# Altium schematic sheet Charger.SchDoc
size A4; SheetNumber: 3; SheetTotal: 3
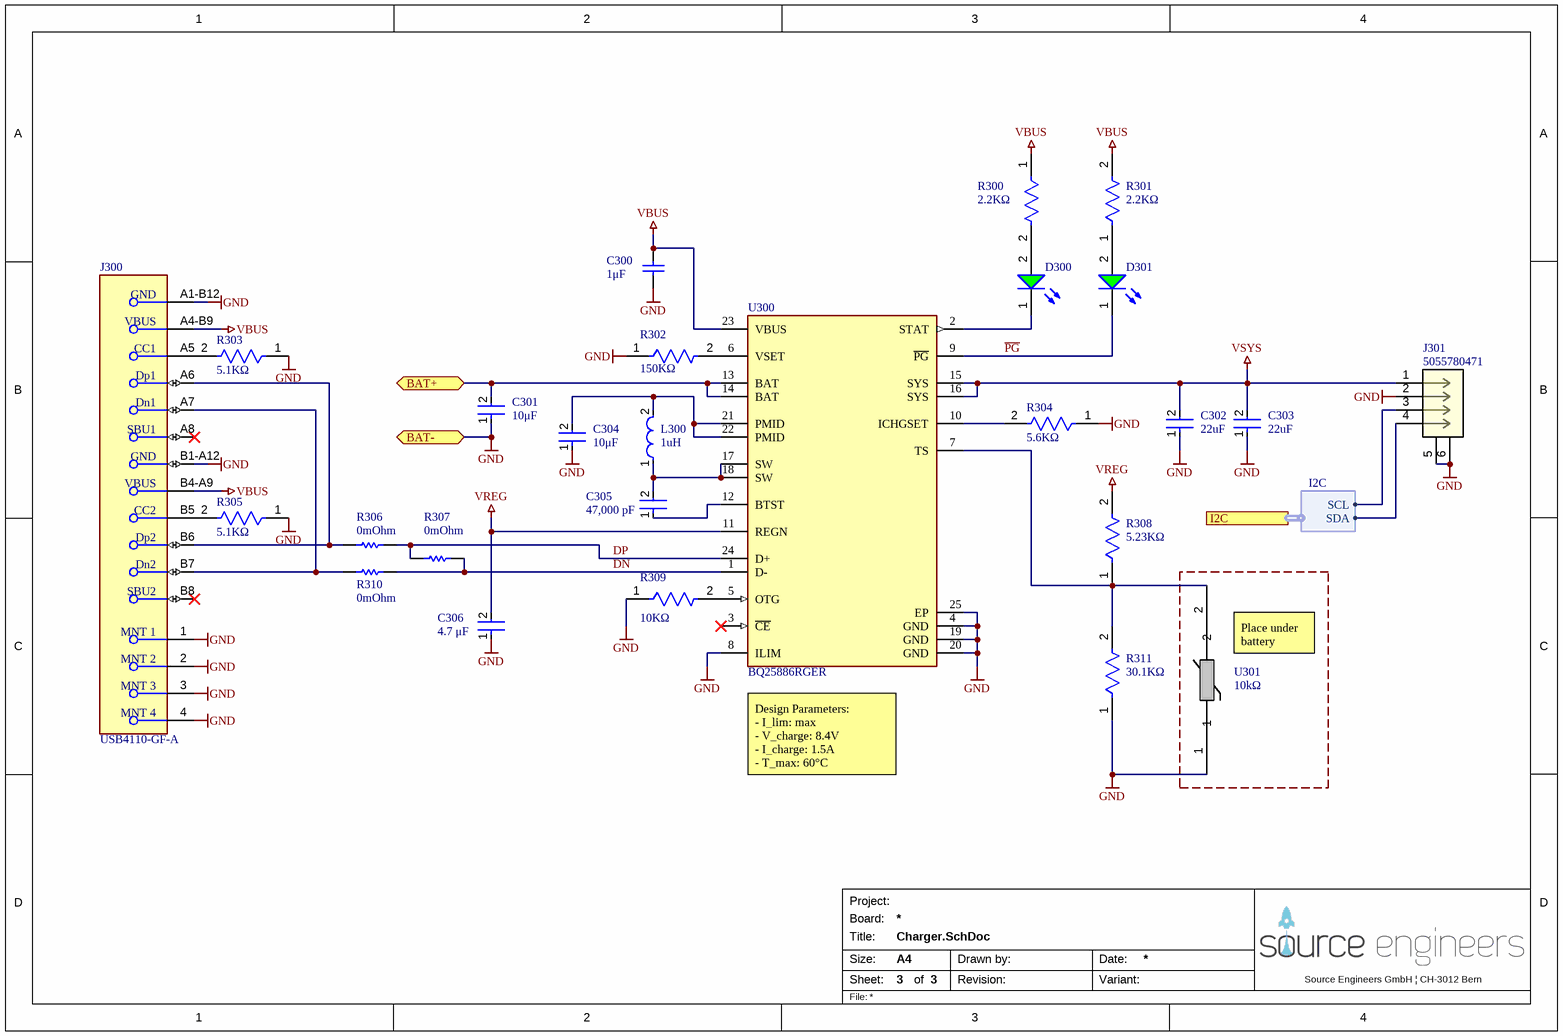
[diagram p0: Charger.SchDoc]

## Parts
C300  Parameter 1: 1μF  [CAPC2013X95X45NL10T25]  (hidden comment: GRM219R71E105KA88D)
C301  value 10μF  [FP-GRM31C-0_2-e0_3_0_8-IPC_B]  (hidden comment: GRM31CR71E106MA12K)
C302  Capacitance: 22uF  [FP-GRM32E-0_3-0_2-MFG]  (hidden comment: GRM32ER71E226ME15K)
C303  Capacitance: 22uF  [FP-GRM32E-0_3-0_2-MFG]  (hidden comment: GRM32ER71E226ME15K)
C304  value 10μF  [FP-GRM31C-0_2-e0_3_0_8-IPC_B]  (hidden comment: GRM31CR71E106MA12K)
C305  value 47,000 pF  [FP-C0603C-CF-MFG]  (hidden comment: C0603C473M5RACTU)
C306  Parameter 1: 4.7 μF  [FP-GRM188-0_15-IPC_B]  (hidden comment: GRM188Z71A475ME15D)
D300  155060VS75300  [WL-SMSW_0603_L1.6W0.98H0.8]  (value not drawn)
D301  155060VS75300  [WL-SMSW_0603_L1.6W0.98H0.8]  (value not drawn)
J300  USB4110-GF-A  [FP-USB4110-GF-A-MFG]
J301  5055780471  [CONN_505578_04_MOL]
L300  Inductance: 1uH  [FP-IHLP-2525CZ-FP_2_413x3-MFG]  (hidden comment: IHLP2525CZER1R0M01)
R300  value 2.2KΩ  [FP-RT0603-MFG]  (hidden comment: RT0603FRE072K2L)
R301  value 2.2KΩ  [FP-RT0603-MFG]  (hidden comment: RT0603FRE072K2L)
R302  value 150KΩ  [FP-RT0603-MFG]  (hidden comment: RT0603FRE07150KL)
R303  Resistance: 5.1KΩ  [FP-RT0603-MFG]  (hidden comment: RT0603FRE075K1L)
R304  value 5.6KΩ  [FP-RT0603-MFG]  (hidden comment: RT0603FRE075K6L)
R305  Resistance: 5.1KΩ  [FP-RT0603-MFG]  (hidden comment: RT0603FRE075K1L)
R306  Resistance: 0mOhm  [RESC1608X55X25ML10T15]  (hidden comment: RC0603JR-070RL)
R307  Resistance: 0mOhm  [RESC1608X55X25ML10T15]  (hidden comment: RC0603JR-070RL)
R308  value 5.23KΩ  [FP-RT0603-MFG]  (hidden comment: RT0603FRE075K23L)
R309  value 10KΩ  [FP-RT0603-MFG]  (hidden comment: RT0603FRE0710KL)
R310  Resistance: 0mOhm  [RESC1608X55X25ML10T15]  (hidden comment: RC0603JR-070RL)
R311  value 30.1KΩ  [FP-RT0603-MFG]  (hidden comment: RT0603FRE0730K1L)
U300  BQ25886RGER  [FP-RGE0024H-IPC_C]
U301  Resistance: 10kΩ  [NTCS0603_VIS]  (hidden comment: NTCS0603E3103FLT)

## Ports
BAT+ (bidir, see Top[3B], MonitoringProtection[1A]), BAT- (bidir, see Top[3B], MonitoringProtection[1D]), I2C (harness I2C, see Top[3C], MonitoringProtection[1C])

## Harnesses
I2C: SCL, SDA

## Nets
GND: C300.1 C301.1 C302.1 C303.1 C304.1 C306.1 J300.1(MNT_1) J300.2(MNT_2) J300.3(MNT_3) J300.4(MNT_4) J300.A1-B12(GND) J300.B1-A12(GND) J301.2 J301.5 J301.6 R302.1 R303.1 R304.1 R305.1 R309.1 R311.1 U300.4(GND) U300.8(ILIM) U300.19(GND) U300.20(GND) U300.25(EP) U301.1 ; port BAT-
VBUS: C300.2 J300.A4-B9(VBUS) J300.B4-A9(VBUS) R300.1 R301.2 U300.23(VBUS)
VREG: C306.2 R308.2 U300.11(REGN)
VSYS: C302.2 C303.2 J301.1 U300.15(SYS) U300.16(SYS)
BAT+: C301.2 U300.13(BAT) U300.14(BAT) ; port BAT+
DN: R307.1 R310.1 U300.1(D-)
DP: R306.1 R307.2 U300.24(D+)
~{PG}: D301.1(K) U300.9(~{PG})
NetC304_2: C304.2 L300.2 U300.21(PMID) U300.22(PMID)
NetC305_1: C305.1 U300.12(BTST)
NetC305_2: C305.2 L300.1 U300.17(SW) U300.18(SW)
NetD300_1: D300.1(K) U300.2(STAT)
NetD300_2: D300.2(A) R300.2
NetD301_2: D301.2(A) R301.1
NetJ300_A5: J300.A5(CC1) R303.2
NetJ300_A6: J300.A6(Dp1) J300.B6(Dp2) R306.2
NetJ300_A7: J300.A7(Dn1) J300.B7(Dn2) R310.2
NetJ300_B5: J300.B5(CC2) R305.2
NetJ301_3: J301.3 ; port I2C.SCL
NetJ301_4: J301.4 ; port I2C.SDA
NetR302_2: R302.2 U300.6(VSET)
NetR304_2: R304.2 U300.10(ICHGSET)
NetR308_1: R308.1 R311.2 U300.7(TS) U301.2
NetR309_2: R309.2 U300.5(OTG)

Not connected (* = marked no-connect by the designer): J300 A8(SBU1)* B8(SBU2)*; U300 3(~{CE})*

## Notes on the sheet
- (near U301) Place under battery
- (near U300) Design Parameters:
  - I_lim: max
  - V_charge: 8.4V
  - I_charge: 1.5A
  - T_max: 60°C
- Project:
- Board:
- Title:
- Size:
- Sheet:
- A4
- of
- Drawn by:
- Revision:
- Date:
- Variant:
- Source Engineers GmbH | CH-3012 Bern
- File:

## Library data of the parts
C300 = CMP-1036-04754-2: Manufacturer: Murata; Part Number: GRM219R71E105KA88D
C301 C304 = CMP-06035-043219-1: Chip Multilayer Ceramic Capacitors for General Purpose, 1206, 10uF, X7R, 15%, 20%, 25V
C302 C303 = CMP-06035-000114-2: Chip Multilayer Ceramic Capacitors for General Purpose, 1210, 22uF, X7R, 15%, 20%, 25V; Case Code (Metric): 3225; Thickness: 0.106inch; Voltage Rating: 25V; Weight: 0.00388oz; Width: 0.098inch; Case Code (Imperial): 1210; Tolerance: 20%; Termination: SMD/SMT; Packaging: Tape and Reel; Case/Package: 1210; Height: 2.5mm; Mount: Surface Mount; Voltage Rating (DC): 25V; Resistor Type: Ceramic; Voltage: 25V; Dielectric: X7R; Package Quantity: 4000; Min Operating Temperature: -55°C; Max Operating Temperature: 125°C; Length: 0.126inch
C305 = CMP-2006-03851-2: CAP CER 0.047UF 50V X7R 0603; Manufacturer: KEMET; Temperature Coefficient: 30ppm/°C; Automotive Grade: Grade 1; Tolerance: 0.2; Material: Ceramic; Voltage Rating: 50 V; Manufacturer Part Number: C0603C473M5RACTU; Device Class L1: Passive Components; Temperature Range High: +125°C; Height: 0.87mm; Device Class L3: Ceramic Capacitors; Capacitance: 47,000 pF; Digikey Description: CAP CER 0.047UF 50V X7R 0603; Temperature Range Low: -55°C; Temperature: -55°C to +125°C; Mouser Description: Cap Ceramic 0.047uF 50V X7R 20% SMD 0603 125°C Paper T/R; ComponentLink2URL: https://api.kemet.com/component-edge/download/datasheet/C0603C100J5GACAUTO.pdf; Package: C0603C-CF; Automotive: Yes; RoHS: TRUE; ComponentLink2Description: Datasheet; Lead Free: Yes; Device Class L2: Capacitors; Temperature Characteristic: X7R; Category: Cap; Octopart: https://octopart.com/c0603c473m5ractu-kemet-9140001
C306 = CMP-06035-024346-1: Chip Multilayer Ceramic Capacitors for General Purpose, 0603, 4.7uF, X7R, 15%, 20%, 10V; Case/Package: 0603
D300 D301 = CMP-03913-108242161-1: 155060VS75300 Led, Green, 60Mcd, 570Nm Rohs Compliant: Yes; Max Reverse Voltage (DC): 5V; Peak Wavelength: 572nm; Viewing Angle: 140°; Forward Current: 30mA; Forward Voltage: 2V; Max Operating Temperature: 85°C; Luminous Intensity: 60mcd; RoHS: Compliant; Width: 980µm; Length: 1.6mm; Min Operating Temperature: -40°C; Dominant Wavelength: 570nm; Height: 800µm; NexarPartId: 108242161
J300 = CMP-245163-000002-1: CONN USB 2.0 TYPE-C R/A SMT; Manufacturer: GCT; Conn Orientation: Right Angle; Usb Standard: USB 2.0; Voltage Rating: 20V; Current Rating: 3/4.25/1.25/0.25A; Number Of Contacts: 16; Is Female: yes; Shielding: true; Standoff Height: 0.1mm; Octopart: https://octopart.com/usb4110-gf-a-gct-103941985; Temperature: -40°C to +85°C; RoHS: TRUE; Automotive: No; Contact Material: Gold,Nickel; Device Class L1: Connectors; Device Class L2: USB Connectors; Package: 0; Lead Free: Yes; ComponentLink2URL: https://gct.co/files/drawings/usb4110.pdf; Temperature Range High: +85°C; Temperature Range Low: -40°C; Height: 3.46mm; Manufacturer Part Number: USB4110-GF-A; ComponentLink2Description: Datasheet; Device Class L3: unset; Digikey Description: CONN USB 2.0 TYPE-C R/A SMT; Category: Conn
J301 = 5055780471: 2.00mm Pitch, Micro-Lock Plus PCB Header, Single Row, Right-Angle, Surface Mount, Matte Tin Plating, Positive Lock, 4 Circuits, Low-Halogen, Black; Manufacturer_Name: Molex Connector Corporation; Copyright: Copyright (C) 2025 Ultra Librarian. All rights reserved.; Manufacturer_Part_Number: 5055780471; Datasheet: https://www.molex.com/en-us/products/part-detail-pdf/5055780471?display=pdf; RefDes: RefDes; Type: Type; Supplier 1: DigiKey; Supplier Part Number 1: WM17949CT-ND; Supplier 2: DigiKey; Supplier Part Number 2: WM17949DKR-ND; Supplier 3: Mouser; Supplier Part Number 3: 538-505578-0471
L300 = CMP-02424-000599-1: Commercial Inductors, High Saturation Series 1uH 11A 10mΩ 20%; Self Resonant Frequency: 5MHz; Test Frequency: 100kHz; Shielding: Shielded; Core Material: Metal; Saturation Current: 22A; DC Resistance (DCR): 10mR; Current Rating: 11A; Packaging: Tape and Reel; Width: 6.47mm; Number of Pins: 2; Case/Package: 2525; Termination: SMD/SMT; Length: 7.24mm; Height: 3mm; Min Operating Temperature: -55°C; Mount: Surface Mount; Inductance Tolerance: 20%; Max Operating Temperature: 125°C; Military Standard: Not; Max DC Current: 11A; RMS Current (Irms): 11A; Lead Free: Lead Free; Depth: 6.72mm; Tolerance: 20%; Package Quantity: 2000; Radiation Hardening: No; Contact Plating: Tin
R300 R301 = CMP-03412-033768-1: RES SMD 2.2K OHM 1% 1/10W 0603; Manufacturer: Yageo; Temperature Coefficient: 50 ppm/°C; Power Rating: 0.1W; Tolerance: 0.01; Voltage Rating: 75V; Package: RT0603; Digikey Description: RES SMD 2.2K OHM 1% 1/10W 0603; Octopart: https://octopart.com/rt0603fre072k2l-yageo-40019811; ComponentLink2URL: http://www.yageo.com/documents/recent/PYu-RT_1-to-0.01_RoHS_L_9.pdf; Temperature Range Low: -55°C; Height: 0.55mm; Footprint Url: http://www.yageo.com/exep/pages/download/literatures/PYu-R_Mount_10.pdf; ComponentLink2Description: Datasheet; Device Class L1: Passive Components; RoHS: TRUE; Device Class L3: Chip SMD Resistors; Composition: Thin Film; Device Class L2: Resistors; Manufacturer Part Number: RT0603FRE072K2L; Mouser Description: High Precision-High Stability Chip Resistor Thin Film 0603 2.2kOhm 1% Paper T/R; Automotive: No; Category: Res; Temperature Range High: +155°C; Lead Free: Yes; Resistance: 2.2KΩ; Temperature: -55°C to +155°C; Series: RT; Ipc Land Pattern Name: RESC16080X45
R302 = CMP-03412-003286-1: RES SMD 150K OHM 1% 1/10W 0603; Manufacturer: Yageo; Power Rating: 0.1W; Voltage Rating: 75V; Tolerance: 0.01; Temperature Coefficient: 50 ppm/°C; Temperature Range Low: -55°C; Category: Res; Mouser Description: High Precision-High Stability Chip Resistor Thin Film 0603 150kOhm 1% Paper T/R; Temperature Range High: +155°C; ComponentLink2Description: Datasheet; Digikey Description: RES SMD 150K OHM 1% 1/10W 0603; Ipc Land Pattern Name: RESC16080X45; Automotive: No; Temperature: -55°C to +155°C; Package: RT0603; Device Class L2: Resistors; RoHS: TRUE; Footprint Url: http://www.yageo.com/exep/pages/download/literatures/PYu-R_Mount_10.pdf; ComponentLink2URL: http://www.yageo.com/documents/recent/PYu-RT_1-to-0.01_RoHS_L_9.pdf; Composition: Thin Film; Manufacturer Part Number: RT0603FRE07150KL; Octopart: https://octopart.com/rt0603fre07150kl-yageo-39990114; Resistance: 150KΩ; Lead Free: Yes; Height: 0.55mm; Series: RT; Device Class L3: Chip SMD Resistors; Device Class L1: Passive Components
R303 R305 = CMP-2000-04778-2: RES SMD 5.1K OHM 1% 1/10W 0603; Manufacturer: Yageo; Value: 5.1KΩ; Temperature Coefficient: 50 ppm/°C; Power Rating: 0.1W; Voltage Rating: 75V; Tolerance: 0.01; Lead Free: Yes; Temperature Range High: +155°C; Package: RT0603; Series: RT; Footprint Url: http://www.yageo.com/exep/pages/download/literatures/PYu-R_Mount_10.pdf; Ipc Land Pattern Name: RESC16080X45; Mouser Description: Res Thin Film 0603 5.1K Ohm 1% 0.1W(1/10W) ±50ppm/C Epoxy Pad SMD T/R; Octopart: https://octopart.com/rt0603fre075k1l-yageo-1421390; ComponentLink2URL: http://www.yageo.com/documents/recent/PYu-RT_1-to-0.01_RoHS_L_9.pdf; Manufacturer Part Number: RT0603FRE075K1L; RoHS: TRUE; Device Class L3: Chip SMD Resistors; Digikey Description: RES SMD 5.1K OHM 1% 1/10W 0603; Temperature: -55°C to +155°C; Height: 0.55mm; Automotive: No; Device Class L1: Passive Components; Temperature Range Low: -55°C; Category: Res; Composition: Thin Film; ComponentLink2Description: Datasheet; Device Class L2: Resistors
R304 = CMP-03412-009081-1: RES SMD 5.6K OHM 1% 1/10W 0603; Manufacturer: Yageo; Tolerance: 0.01; Voltage Rating: 75V; Temperature Coefficient: 50 ppm/°C; Power Rating: 0.1W; Package: RT0603; Manufacturer Part Number: RT0603FRE075K6L; Footprint Url: http://www.yageo.com/exep/pages/download/literatures/PYu-R_Mount_10.pdf; Composition: Thin Film; Category: Res; RoHS: TRUE; Resistance: 5.6KΩ; ComponentLink2Description: Datasheet; Lead Free: Yes; Automotive: No; Temperature Range Low: -55°C; Series: RT; Temperature: -55°C to +155°C; Mouser Description: Res Thin Film 0603 5.6K Ohm 1% 1/10W ?50ppm/C Molded SMD SMD Paper T/R; Temperature Range High: +155°C; Device Class L3: Chip SMD Resistors; Digikey Description: RES SMD 5.6K OHM 1% 1/10W 0603; Octopart: https://octopart.com/rt0603fre075k6l-yageo-40030215; Device Class L2: Resistors; Ipc Land Pattern Name: RESC16080X45; Device Class L1: Passive Components; ComponentLink2URL: http://www.yageo.com/documents/recent/PYu-RT_1-to-0.01_RoHS_L_9.pdf; Height: 0.55mm
R306 R307 R310 = CMP-2100-03667-1: Chip Resistor, 0 Ohm, +/- 5%, 0.1 W, -55 to 155 degC, 0603 (1608 Metric), RoHS, Tape and Reel; Manufacturer: Yageo; Temperature Coefficient: 200ppm/degreesC; Voltage Rating: 50V; Power Rating: 100mW; Width: 0.8mm; Max Operating Temperature: 155degC; Tolerance: 5%; Package Reference: 0603; Height: 0.45mm; Depth: 0.8mm; Package Description: 2-Pin Surface Mount Device, Body 1.6 x 0.8 mm; Termination: SMD/SMT; Package Quantity: 5000; Case/Package: 0603; Case Code (Imperial): 0603; Radiation Hardening: No; Number of Pins: 2; Length: 1.6mm; Lead Free: LeadFree; Voltage Rating (DC): 50V; Military Standard: Not; Datasheet URL: http://www.yageo.com/NewPortal/yageodocoutput?fileName=/pdf/R-Chip/PYu-RC_Group_51_RoHS_L_5.pdf; Manufacturer URL: http://www.yageo.com/; Packaging: TapeandReel; Case Code (Metric): 1608; Min Operating Temperature: -55degC; Composition: ThickFilm; RoHSCompliant: true; Contact Plating: Tin; Datasheet Version: Rev. 5, 10/2016; REACH SVHC: NoSVHC
R308 = CMP-03412-006003-1: RES SMD 5.23K OHM 1% 1/10W 0603; Manufacturer: Yageo; Temperature Coefficient: 50 ppm/°C; Voltage Rating: 75V; Power Rating: 0.1W; Tolerance: 0.01; Device Class L2: Resistors; Temperature Range High: +155°C; ComponentLink2Description: Datasheet; Octopart: https://octopart.com/rt0603fre075k23l-yageo-1422860; Height: 0.55mm; Mouser Description: Thin Film Resistors 1/10W 5.23K ohm 1% 50ppm; Manufacturer Part Number: RT0603FRE075K23L; Composition: Thin Film; Series: RT; Resistance: 5.23KΩ; Automotive: No; Device Class L1: Passive Components; RoHS: TRUE; Package: RT0603; Lead Free: Yes; Footprint Url: http://www.yageo.com/exep/pages/download/literatures/PYu-R_Mount_10.pdf; Temperature Range Low: -55°C; ComponentLink2URL: http://www.yageo.com/documents/recent/PYu-RT_1-to-0.01_RoHS_L_9.pdf; Device Class L3: Chip SMD Resistors; Digikey Description: RES SMD 5.23K OHM 1% 1/10W 0603; Ipc Land Pattern Name: RESC16080X45; Temperature: -55°C to +155°C; Category: Res
R309 = CMP-03412-005349-1: RES SMD 10K OHM 1% 1/10W 0603; Manufacturer: Yageo; Temperature Coefficient: 50 ppm/°C; Power Rating: 0.1W; Tolerance: 0.01; Voltage Rating: 75V; RoHS: TRUE; Category: Res; Automotive: No; Digikey Description: RES SMD 10K OHM 1% 1/10W 0603; ComponentLink2Description: Datasheet; Octopart: https://octopart.com/rt0603fre0710kl-yageo-40009243; ComponentLink2URL: http://www.yageo.com/documents/recent/PYu-RT_1-to-0.01_RoHS_L_9.pdf; Device Class L3: Chip SMD Resistors; Device Class L1: Passive Components; Temperature Range High: +155°C; Height: 0.55mm; Composition: Thin Film; Ipc Land Pattern Name: RESC16080X45; Series: RT; Package: RT0603; Resistance: 10KΩ; Footprint Url: http://www.yageo.com/exep/pages/download/literatures/PYu-R_Mount_10.pdf; Temperature: -55°C to +155°C; Temperature Range Low: -55°C; Lead Free: Yes; Device Class L2: Resistors; Mouser Description: Thin Film Resistors - SMD 10K ohm 1% 1/10W; Manufacturer Part Number: RT0603FRE0710KL
R311 = CMP-2000-04723-2: RES SMD 30.1K OHM 1% 1/10W 0603; Manufacturer: Yageo; Power Rating: 0.1W; Temperature Coefficient: 50 ppm/°C; Tolerance: 0.01; Voltage Rating: 75V; RoHS: TRUE; Temperature: -55°C to +155°C; Device Class L3: Chip SMD Resistors; Lead Free: Yes; Temperature Range Low: -55°C; ComponentLink2Description: Datasheet; Automotive: No; Height: 0.55mm; Footprint Url: http://www.yageo.com/exep/pages/download/literatures/PYu-R_Mount_10.pdf; ComponentLink2URL: http://www.yageo.com/documents/recent/PYu-RT_1-to-0.01_RoHS_L_9.pdf; Octopart: https://octopart.com/rt0603fre0730k1l-yageo-1278177; Series: RT; Ipc Land Pattern Name: RESC16080X45; Category: Res; Digikey Description: RES SMD 30.1K OHM 1% 1/10W 0603; Device Class L1: Passive Components; Package: RT0603; Composition: Thin Film; Temperature Range High: +155°C; Mouser Description: Res Thin Film 0603 30.1K Ohm 1% 1/10W ±50ppm/°C SMD Paper T/R; Device Class L2: Resistors; Manufacturer Part Number: RT0603FRE0730K1L; Resistance: 30.1KΩ
U300 = CMP-04911-000046-1: PWR MGMT BATTERY MGMT
U301 = CMP-02404-000014-2: THERMISTOR NTC 10KOHM 3435K 0603; NexarPartId: 44562204; Tolerance: 1%; Power Rating: 125mW; Case Code (Metric): 1608; Packaging: Cut Tape (CT); Min Operating Temperature: -40°C; RoHS: Compliant; Height: 800µm; Depth: 800µm; Case/Package: 0603; Length: 1.6mm; Number of Pins: 2; Termination: SMD/SMT; Schedule B: 8533400080, 8533400080; Weight: 1.19068mg; Contact Plating: Tin; Max Power Dissipation: 125mW; Max Operating Temperature: 150°C; Mount: Surface Mount; Case Code (Imperial): 0603; Width: 800µm